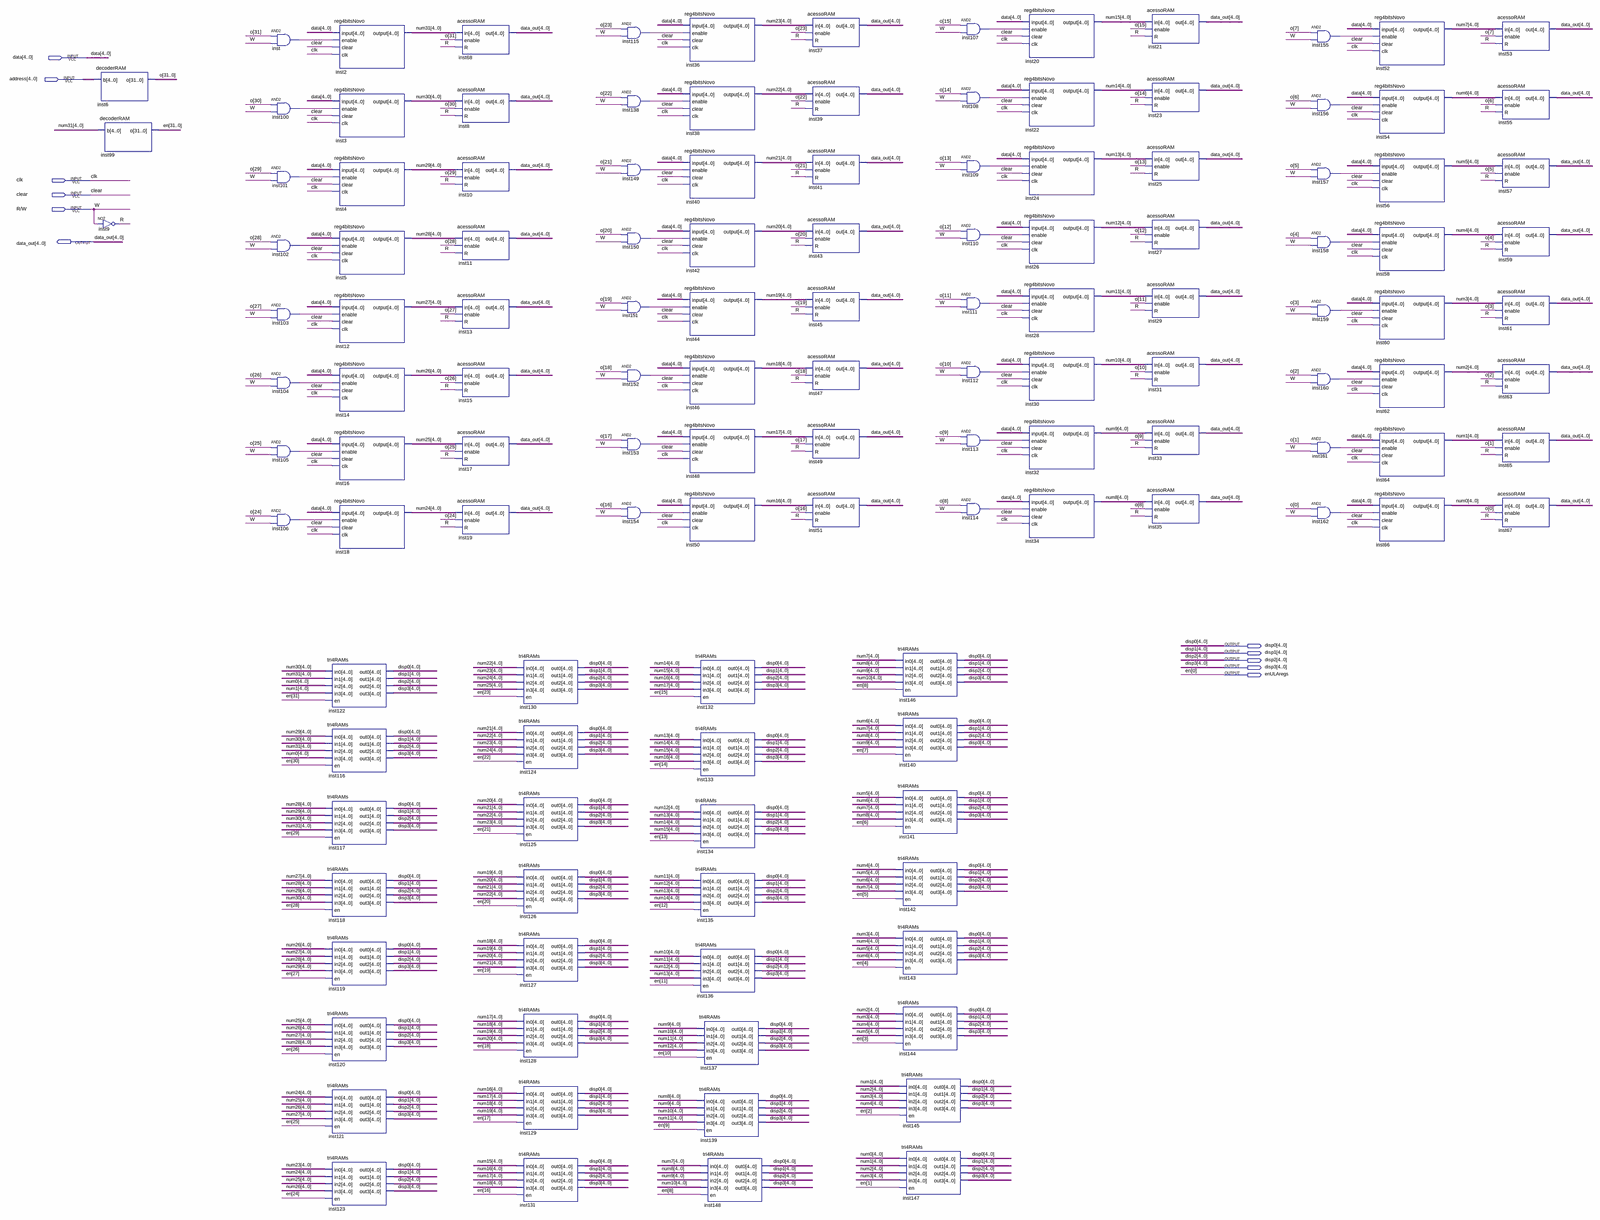
[diagram p0: schematic sheet, whole]
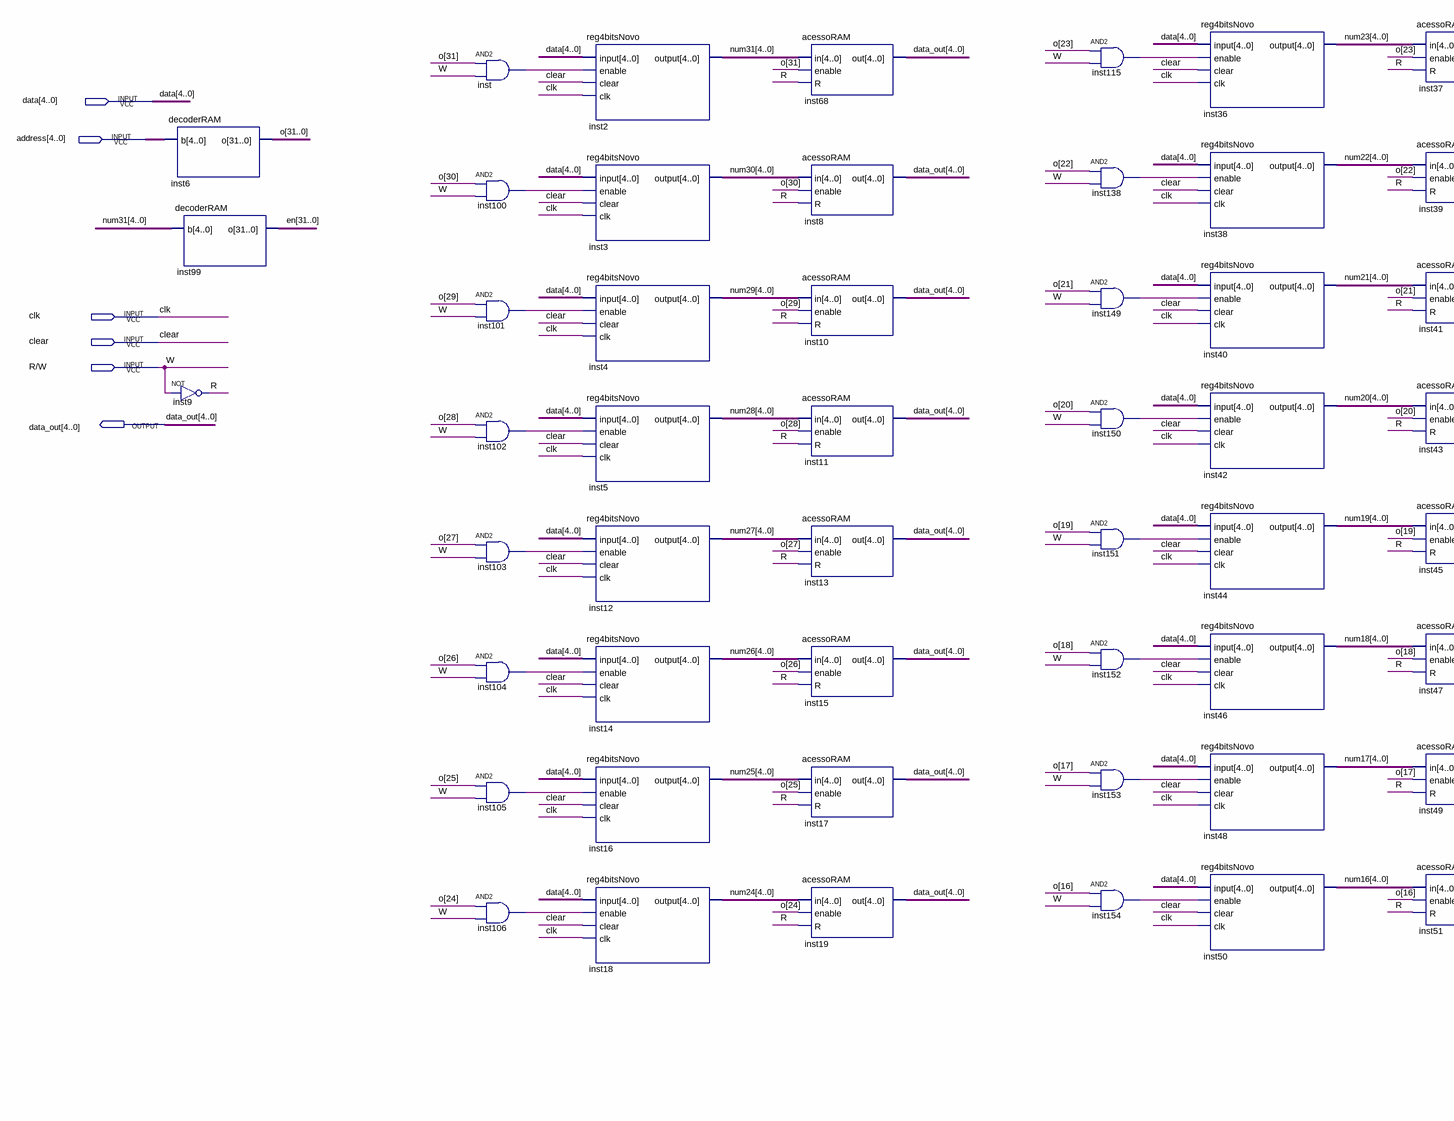
[diagram p1: schematic sheet, upper left part]
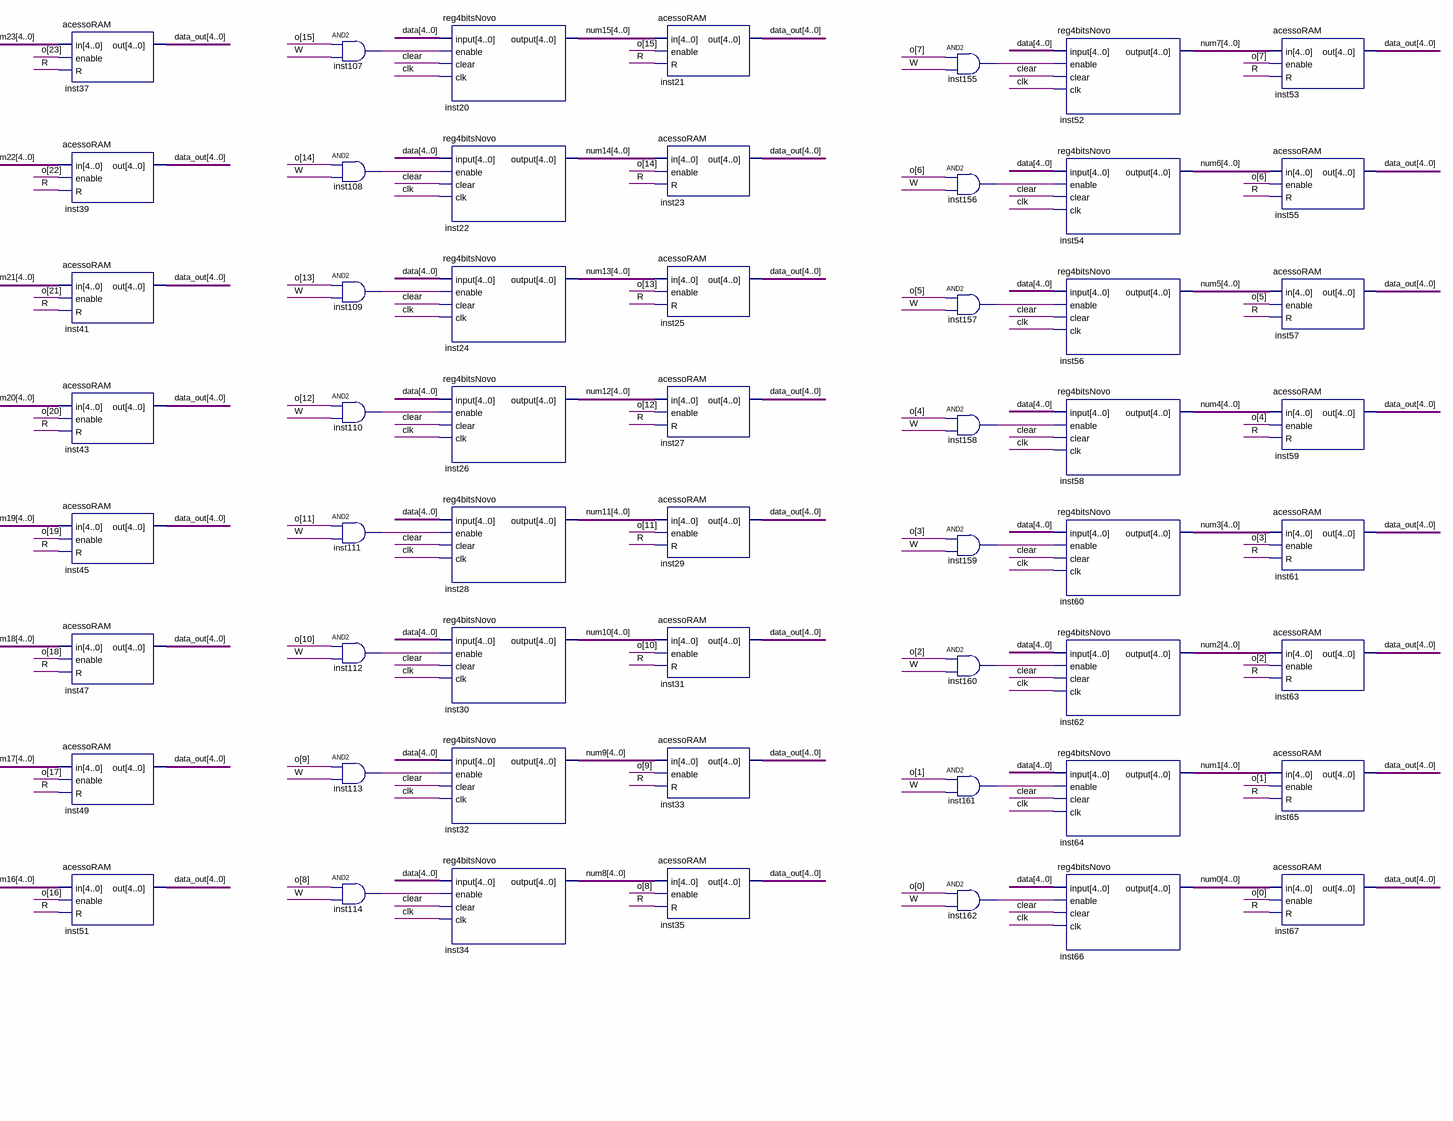
[diagram p2: schematic sheet, upper right part]
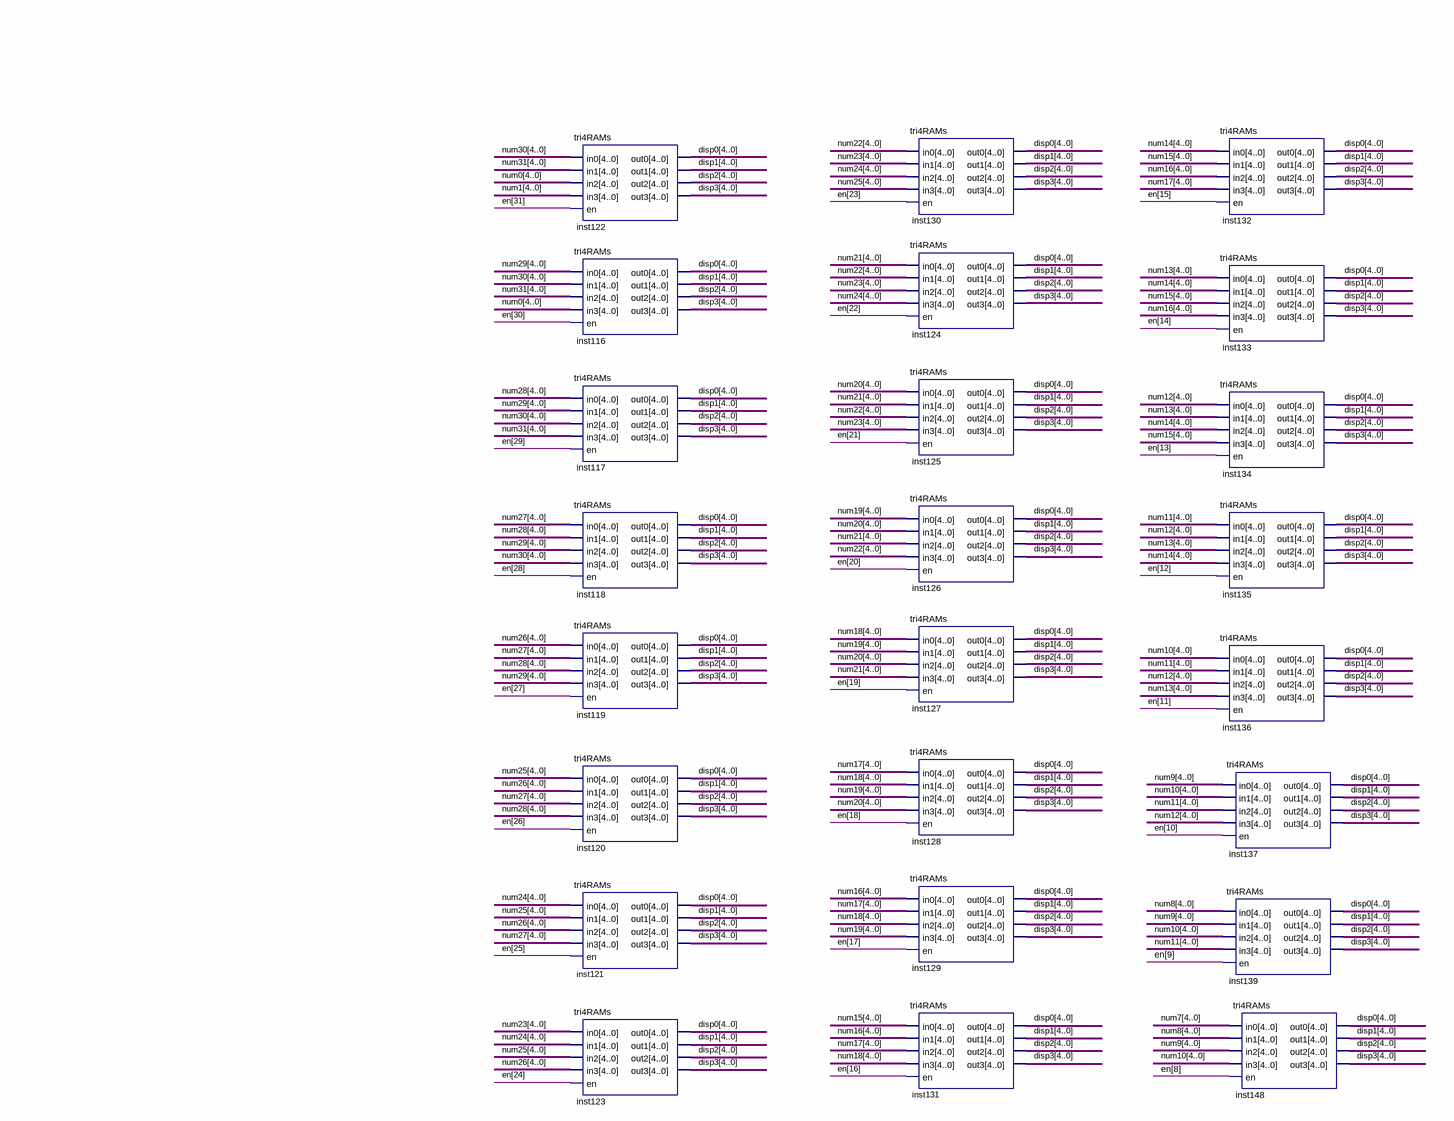
[diagram p3: schematic sheet, lower left part]
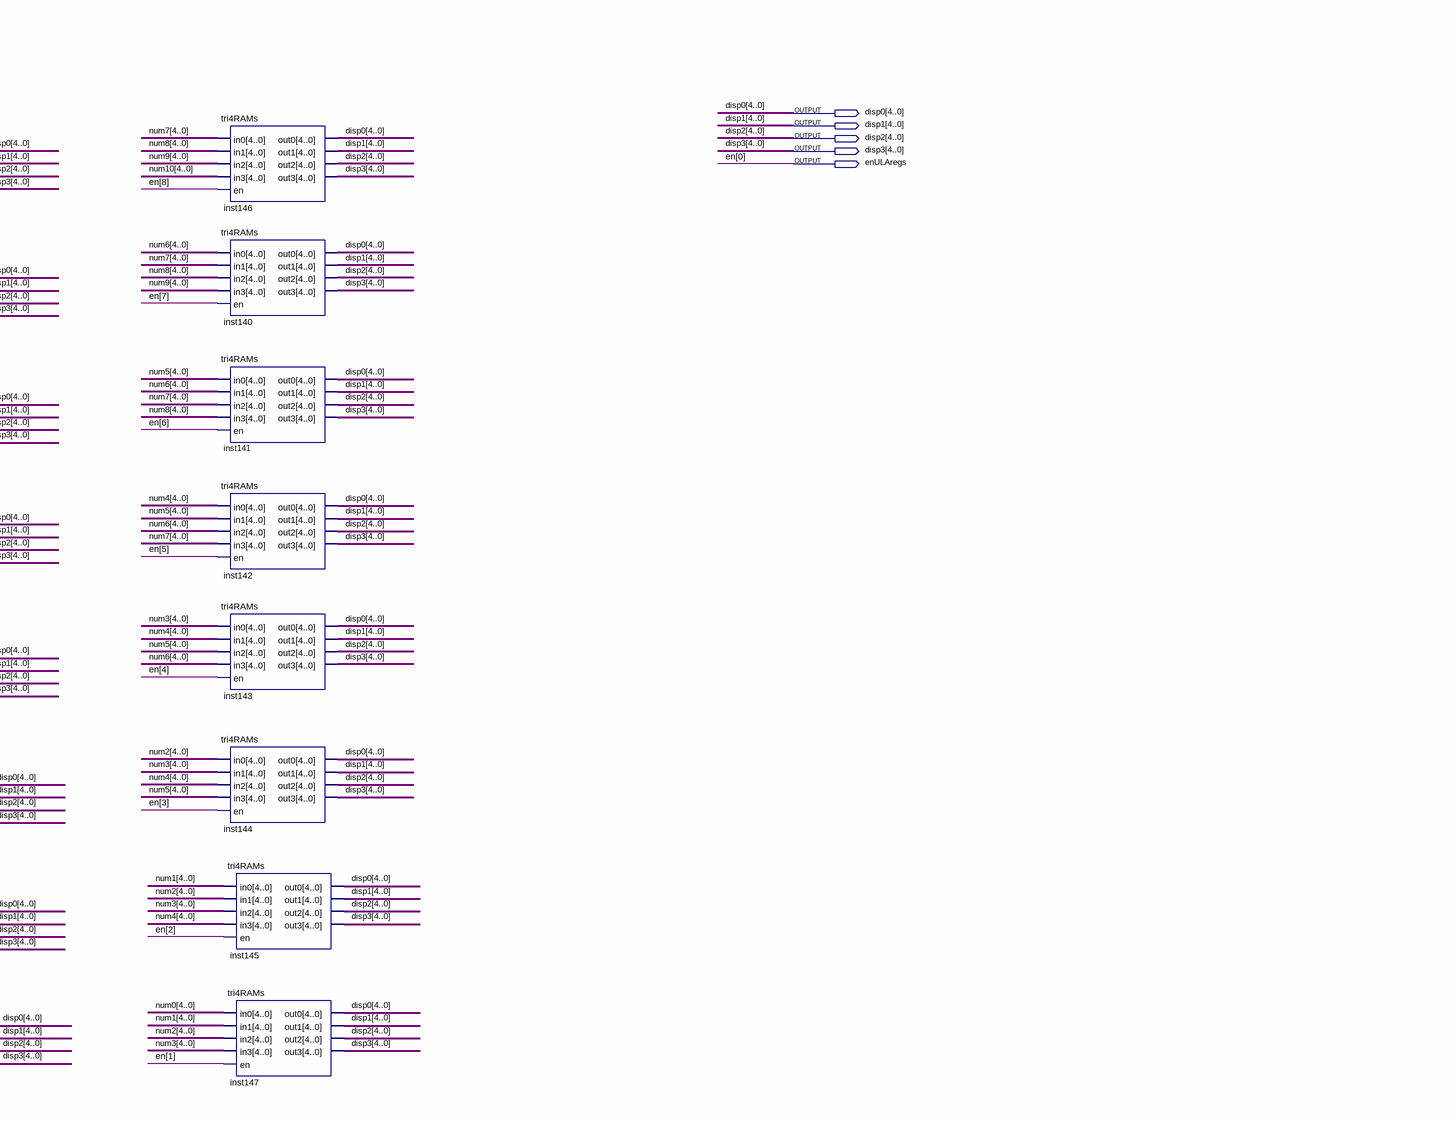
[diagram p4: schematic sheet, lower right part]
// Quartus schematic memoriaRAM(1).bdf as structural Verilog: 131 symbols, 11 pins
module \memoriaRAM(1)  (
  input  [4:0] data,
  input  [4:0] address,
  input  clk,
  input  clear,
  input  \R/W ,
  output [4:0] data_out,
  output [4:0] disp0,
  output [4:0] disp1,
  output [4:0] disp2,
  output [4:0] disp3,
  output enULAregs
);

  wire inst100_out, inst101_out, inst102_out, inst103_out, inst104_out, inst105_out, inst106_out,
       inst107_out, inst108_out, inst109_out, inst110_out, inst111_out, inst112_out, inst113_out,
       inst114_out, inst115_out, inst138_out, inst149_out, inst150_out, inst151_out, inst152_out,
       inst153_out, inst154_out, inst155_out, inst156_out, inst157_out, inst158_out, inst159_out,
       inst160_out, inst161_out, inst162_out, inst_out, R;
  wire [4:0] num0, num1, num2, num3, num4, num5, num6, num7, num8, num9, num10, num11, num12, num13, num14,
       num15, num16, num17, num18, num19, num20, num21, num22, num23, num24, num25, num26, num27, num28,
       num29, num30, num31;
  wire [31:0] o;
  wire [31:1] en;

  decoderRAM inst6 (.b(address), .o(o));
  decoderRAM inst99 (.b(num31), .o({en, enULAregs}));
  not inst9 (R, \R/W );
  and inst (inst_out, o[31], \R/W );
  and inst100 (inst100_out, o[30], \R/W );
  and inst101 (inst101_out, o[29], \R/W );
  and inst102 (inst102_out, o[28], \R/W );
  and inst103 (inst103_out, o[27], \R/W );
  and inst104 (inst104_out, o[26], \R/W );
  and inst105 (inst105_out, o[25], \R/W );
  and inst106 (inst106_out, o[24], \R/W );
  reg4bitsNovo inst2 (.\input (data), .enable(inst_out), .clear(clear), .clk(clk), .\output (num31));
  reg4bitsNovo inst3 (.\input (data), .enable(inst100_out), .clear(clear), .clk(clk), .\output (num30));
  reg4bitsNovo inst4 (.\input (data), .enable(inst101_out), .clear(clear), .clk(clk), .\output (num29));
  reg4bitsNovo inst5 (.\input (data), .enable(inst102_out), .clear(clear), .clk(clk), .\output (num28));
  reg4bitsNovo inst12 (.\input (data), .enable(inst103_out), .clear(clear), .clk(clk), .\output (num27));
  reg4bitsNovo inst14 (.\input (data), .enable(inst104_out), .clear(clear), .clk(clk), .\output (num26));
  reg4bitsNovo inst16 (.\input (data), .enable(inst105_out), .clear(clear), .clk(clk), .\output (num25));
  reg4bitsNovo inst18 (.\input (data), .enable(inst106_out), .clear(clear), .clk(clk), .\output (num24));
  tri4RAMs inst122 (
    .in0(num30), .in1(num31), .in2(num0), .in3(num1), .en(en[31]), .out0(disp0), .out1(disp1), .out2(disp2),
    .out3(disp3));
  tri4RAMs inst116 (
    .in0(num29), .in1(num30), .in2(num31), .in3(num0), .en(en[30]), .out0(disp0), .out1(disp1), .out2(disp2),
    .out3(disp3));
  tri4RAMs inst117 (
    .in0(num28), .in1(num29), .in2(num30), .in3(num31), .en(en[29]), .out0(disp0), .out1(disp1),
    .out2(disp2), .out3(disp3));
  tri4RAMs inst118 (
    .in0(num27), .in1(num28), .in2(num29), .in3(num30), .en(en[28]), .out0(disp0), .out1(disp1),
    .out2(disp2), .out3(disp3));
  tri4RAMs inst119 (
    .in0(num26), .in1(num27), .in2(num28), .in3(num29), .en(en[27]), .out0(disp0), .out1(disp1),
    .out2(disp2), .out3(disp3));
  tri4RAMs inst120 (
    .in0(num25), .in1(num26), .in2(num27), .in3(num28), .en(en[26]), .out0(disp0), .out1(disp1),
    .out2(disp2), .out3(disp3));
  tri4RAMs inst121 (
    .in0(num24), .in1(num25), .in2(num26), .in3(num27), .en(en[25]), .out0(disp0), .out1(disp1),
    .out2(disp2), .out3(disp3));
  tri4RAMs inst123 (
    .in0(num23), .in1(num24), .in2(num25), .in3(num26), .en(en[24]), .out0(disp0), .out1(disp1),
    .out2(disp2), .out3(disp3));
  acessoRAM inst68 (.in(num31), .enable(o[31]), .R(R), .out(data_out));
  acessoRAM inst8 (.in(num30), .enable(o[30]), .R(R), .out(data_out));
  acessoRAM inst10 (.in(num29), .enable(o[29]), .R(R), .out(data_out));
  acessoRAM inst11 (.in(num28), .enable(o[28]), .R(R), .out(data_out));
  acessoRAM inst13 (.in(num27), .enable(o[27]), .R(R), .out(data_out));
  acessoRAM inst15 (.in(num26), .enable(o[26]), .R(R), .out(data_out));
  acessoRAM inst17 (.in(num25), .enable(o[25]), .R(R), .out(data_out));
  acessoRAM inst19 (.in(num24), .enable(o[24]), .R(R), .out(data_out));
  tri4RAMs inst130 (
    .in0(num22), .in1(num23), .in2(num24), .in3(num25), .en(en[23]), .out0(disp0), .out1(disp1),
    .out2(disp2), .out3(disp3));
  tri4RAMs inst124 (
    .in0(num21), .in1(num22), .in2(num23), .in3(num24), .en(en[22]), .out0(disp0), .out1(disp1),
    .out2(disp2), .out3(disp3));
  tri4RAMs inst125 (
    .in0(num20), .in1(num21), .in2(num22), .in3(num23), .en(en[21]), .out0(disp0), .out1(disp1),
    .out2(disp2), .out3(disp3));
  tri4RAMs inst126 (
    .in0(num19), .in1(num20), .in2(num21), .in3(num22), .en(en[20]), .out0(disp0), .out1(disp1),
    .out2(disp2), .out3(disp3));
  tri4RAMs inst127 (
    .in0(num18), .in1(num19), .in2(num20), .in3(num21), .en(en[19]), .out0(disp0), .out1(disp1),
    .out2(disp2), .out3(disp3));
  tri4RAMs inst128 (
    .in0(num17), .in1(num18), .in2(num19), .in3(num20), .en(en[18]), .out0(disp0), .out1(disp1),
    .out2(disp2), .out3(disp3));
  tri4RAMs inst129 (
    .in0(num16), .in1(num17), .in2(num18), .in3(num19), .en(en[17]), .out0(disp0), .out1(disp1),
    .out2(disp2), .out3(disp3));
  tri4RAMs inst131 (
    .in0(num15), .in1(num16), .in2(num17), .in3(num18), .en(en[16]), .out0(disp0), .out1(disp1),
    .out2(disp2), .out3(disp3));
  and inst115 (inst115_out, o[23], \R/W );
  and inst138 (inst138_out, o[22], \R/W );
  and inst149 (inst149_out, o[21], \R/W );
  and inst150 (inst150_out, o[20], \R/W );
  and inst151 (inst151_out, o[19], \R/W );
  and inst152 (inst152_out, o[18], \R/W );
  and inst153 (inst153_out, o[17], \R/W );
  and inst154 (inst154_out, o[16], \R/W );
  reg4bitsNovo inst36 (.\input (data), .enable(inst115_out), .clear(clear), .clk(clk), .\output (num23));
  reg4bitsNovo inst38 (.\input (data), .enable(inst138_out), .clear(clear), .clk(clk), .\output (num22));
  reg4bitsNovo inst40 (.\input (data), .enable(inst149_out), .clear(clear), .clk(clk), .\output (num21));
  reg4bitsNovo inst42 (.\input (data), .enable(inst150_out), .clear(clear), .clk(clk), .\output (num20));
  reg4bitsNovo inst44 (.\input (data), .enable(inst151_out), .clear(clear), .clk(clk), .\output (num19));
  reg4bitsNovo inst46 (.\input (data), .enable(inst152_out), .clear(clear), .clk(clk), .\output (num18));
  reg4bitsNovo inst48 (.\input (data), .enable(inst153_out), .clear(clear), .clk(clk), .\output (num17));
  reg4bitsNovo inst50 (.\input (data), .enable(inst154_out), .clear(clear), .clk(clk), .\output (num16));
  tri4RAMs inst132 (
    .in0(num14), .in1(num15), .in2(num16), .in3(num17), .en(en[15]), .out0(disp0), .out1(disp1),
    .out2(disp2), .out3(disp3));
  tri4RAMs inst133 (
    .in0(num13), .in1(num14), .in2(num15), .in3(num16), .en(en[14]), .out0(disp0), .out1(disp1),
    .out2(disp2), .out3(disp3));
  tri4RAMs inst134 (
    .in0(num12), .in1(num13), .in2(num14), .in3(num15), .en(en[13]), .out0(disp0), .out1(disp1),
    .out2(disp2), .out3(disp3));
  tri4RAMs inst135 (
    .in0(num11), .in1(num12), .in2(num13), .in3(num14), .en(en[12]), .out0(disp0), .out1(disp1),
    .out2(disp2), .out3(disp3));
  tri4RAMs inst136 (
    .in0(num10), .in1(num11), .in2(num12), .in3(num13), .en(en[11]), .out0(disp0), .out1(disp1),
    .out2(disp2), .out3(disp3));
  tri4RAMs inst137 (
    .in0(num9), .in1(num10), .in2(num11), .in3(num12), .en(en[10]), .out0(disp0), .out1(disp1), .out2(disp2),
    .out3(disp3));
  tri4RAMs inst139 (
    .in0(num8), .in1(num9), .in2(num10), .in3(num11), .en(en[9]), .out0(disp0), .out1(disp1), .out2(disp2),
    .out3(disp3));
  tri4RAMs inst148 (
    .in0(num7), .in1(num8), .in2(num9), .in3(num10), .en(en[8]), .out0(disp0), .out1(disp1), .out2(disp2),
    .out3(disp3));
  acessoRAM inst37 (.in(num23), .enable(o[23]), .R(R), .out(data_out));
  acessoRAM inst39 (.in(num22), .enable(o[22]), .R(R), .out(data_out));
  acessoRAM inst41 (.in(num21), .enable(o[21]), .R(R), .out(data_out));
  acessoRAM inst43 (.in(num20), .enable(o[20]), .R(R), .out(data_out));
  acessoRAM inst45 (.in(num19), .enable(o[19]), .R(R), .out(data_out));
  acessoRAM inst47 (.in(num18), .enable(o[18]), .R(R), .out(data_out));
  acessoRAM inst49 (.in(num17), .enable(o[17]), .R(R), .out(data_out));
  acessoRAM inst51 (.in(num16), .enable(o[16]), .R(R), .out(data_out));
  tri4RAMs inst146 (
    .in0(num7), .in1(num8), .in2(num9), .in3(num10), .en(en[8]), .out0(disp0), .out1(disp1), .out2(disp2),
    .out3(disp3));
  tri4RAMs inst140 (
    .in0(num6), .in1(num7), .in2(num8), .in3(num9), .en(en[7]), .out0(disp0), .out1(disp1), .out2(disp2),
    .out3(disp3));
  tri4RAMs inst141 (
    .in0(num5), .in1(num6), .in2(num7), .in3(num8), .en(en[6]), .out0(disp0), .out1(disp1), .out2(disp2),
    .out3(disp3));
  tri4RAMs inst142 (
    .in0(num4), .in1(num5), .in2(num6), .in3(num7), .en(en[5]), .out0(disp0), .out1(disp1), .out2(disp2),
    .out3(disp3));
  tri4RAMs inst143 (
    .in0(num3), .in1(num4), .in2(num5), .in3(num6), .en(en[4]), .out0(disp0), .out1(disp1), .out2(disp2),
    .out3(disp3));
  tri4RAMs inst144 (
    .in0(num2), .in1(num3), .in2(num4), .in3(num5), .en(en[3]), .out0(disp0), .out1(disp1), .out2(disp2),
    .out3(disp3));
  tri4RAMs inst145 (
    .in0(num1), .in1(num2), .in2(num3), .in3(num4), .en(en[2]), .out0(disp0), .out1(disp1), .out2(disp2),
    .out3(disp3));
  tri4RAMs inst147 (
    .in0(num0), .in1(num1), .in2(num2), .in3(num3), .en(en[1]), .out0(disp0), .out1(disp1), .out2(disp2),
    .out3(disp3));
  and inst107 (inst107_out, o[15], \R/W );
  and inst108 (inst108_out, o[14], \R/W );
  and inst109 (inst109_out, o[13], \R/W );
  and inst110 (inst110_out, o[12], \R/W );
  and inst111 (inst111_out, o[11], \R/W );
  and inst112 (inst112_out, o[10], \R/W );
  and inst113 (inst113_out, o[9], \R/W );
  and inst114 (inst114_out, o[8], \R/W );
  reg4bitsNovo inst20 (.\input (data), .enable(inst107_out), .clear(clear), .clk(clk), .\output (num15));
  reg4bitsNovo inst22 (.\input (data), .enable(inst108_out), .clear(clear), .clk(clk), .\output (num14));
  reg4bitsNovo inst24 (.\input (data), .enable(inst109_out), .clear(clear), .clk(clk), .\output (num13));
  reg4bitsNovo inst26 (.\input (data), .enable(inst110_out), .clear(clear), .clk(clk), .\output (num12));
  reg4bitsNovo inst28 (.\input (data), .enable(inst111_out), .clear(clear), .clk(clk), .\output (num11));
  reg4bitsNovo inst30 (.\input (data), .enable(inst112_out), .clear(clear), .clk(clk), .\output (num10));
  reg4bitsNovo inst32 (.\input (data), .enable(inst113_out), .clear(clear), .clk(clk), .\output (num9));
  reg4bitsNovo inst34 (.\input (data), .enable(inst114_out), .clear(clear), .clk(clk), .\output (num8));
  acessoRAM inst21 (.in(num15), .enable(o[15]), .R(R), .out(data_out));
  acessoRAM inst23 (.in(num14), .enable(o[14]), .R(R), .out(data_out));
  acessoRAM inst25 (.in(num13), .enable(o[13]), .R(R), .out(data_out));
  acessoRAM inst27 (.in(num12), .enable(o[12]), .R(R), .out(data_out));
  acessoRAM inst29 (.in(num11), .enable(o[11]), .R(R), .out(data_out));
  acessoRAM inst31 (.in(num10), .enable(o[10]), .R(R), .out(data_out));
  acessoRAM inst33 (.in(num9), .enable(o[9]), .R(R), .out(data_out));
  acessoRAM inst35 (.in(num8), .enable(o[8]), .R(R), .out(data_out));
  and inst155 (inst155_out, o[7], \R/W );
  and inst156 (inst156_out, o[6], \R/W );
  and inst157 (inst157_out, o[5], \R/W );
  and inst158 (inst158_out, o[4], \R/W );
  and inst159 (inst159_out, o[3], \R/W );
  and inst160 (inst160_out, o[2], \R/W );
  and inst161 (inst161_out, o[1], \R/W );
  and inst162 (inst162_out, o[0], \R/W );
  reg4bitsNovo inst52 (.\input (data), .enable(inst155_out), .clear(clear), .clk(clk), .\output (num7));
  reg4bitsNovo inst54 (.\input (data), .enable(inst156_out), .clear(clear), .clk(clk), .\output (num6));
  reg4bitsNovo inst56 (.\input (data), .enable(inst157_out), .clear(clear), .clk(clk), .\output (num5));
  reg4bitsNovo inst58 (.\input (data), .enable(inst158_out), .clear(clear), .clk(clk), .\output (num4));
  reg4bitsNovo inst60 (.\input (data), .enable(inst159_out), .clear(clear), .clk(clk), .\output (num3));
  reg4bitsNovo inst62 (.\input (data), .enable(inst160_out), .clear(clear), .clk(clk), .\output (num2));
  reg4bitsNovo inst64 (.\input (data), .enable(inst161_out), .clear(clear), .clk(clk), .\output (num1));
  reg4bitsNovo inst66 (.\input (data), .enable(inst162_out), .clear(clear), .clk(clk), .\output (num0));
  acessoRAM inst53 (.in(num7), .enable(o[7]), .R(R), .out(data_out));
  acessoRAM inst55 (.in(num6), .enable(o[6]), .R(R), .out(data_out));
  acessoRAM inst57 (.in(num5), .enable(o[5]), .R(R), .out(data_out));
  acessoRAM inst59 (.in(num4), .enable(o[4]), .R(R), .out(data_out));
  acessoRAM inst61 (.in(num3), .enable(o[3]), .R(R), .out(data_out));
  acessoRAM inst63 (.in(num2), .enable(o[2]), .R(R), .out(data_out));
  acessoRAM inst65 (.in(num1), .enable(o[1]), .R(R), .out(data_out));
  acessoRAM inst67 (.in(num0), .enable(o[0]), .R(R), .out(data_out));

  // Other names for the same wires on the sheet: en[0] = enULAregs; W = \R/W 
endmodule
